# EAGLE schematic coyoho-easyvr (EAGLE 5.10)
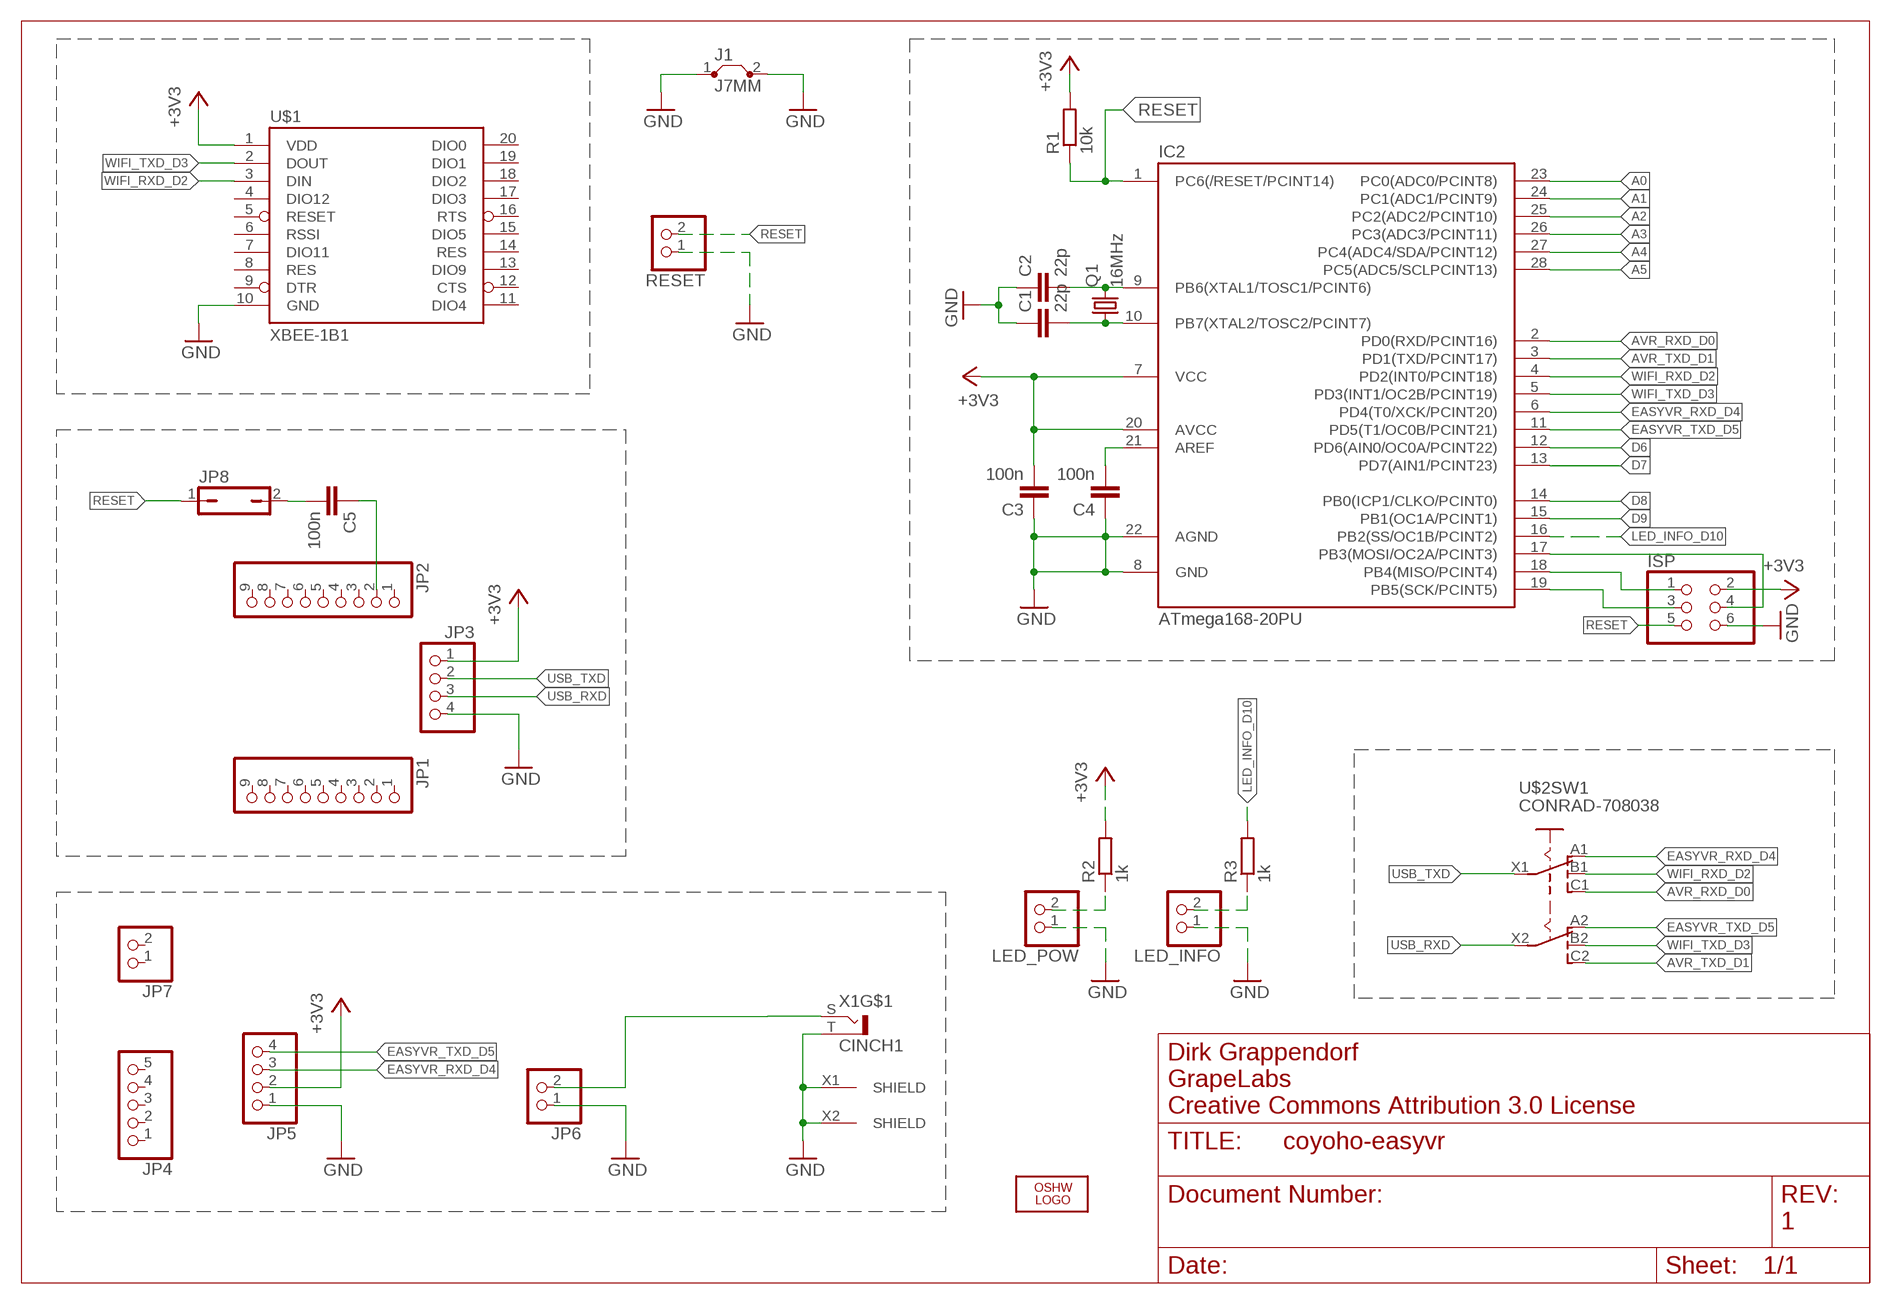
[diagram p0: schematic, sheet 1]

## Parts
C1  22p  C-EU025-025X050  [C025-025X050]
C2  22p  C-EU025-025X050  [C025-025X050]
C3  100n  C-EU025-024X044  [C025-024X044]
C4  100n  C-EU025-024X044  [C025-024X044]
C5  100n  C-EU025-024X044  [C025-024X044]
IC2  ATmega168-20PU  ATMEGA48/88/168-PU  [DIL28-3]
ISP  PINHD-2X3  [2X03]
J1  J7MM  [07]
JP1  PINHD-1X9  [1X09]
JP2  PINHD-1X9  [1X09]
JP3  PINHD-1X4  [1X04]
JP4  PINHD-1X5_2.00  [1X05M]
JP5  PINHD-1X4_2.00  [1X04M]
JP6  PINHD-1X2_2.00  [1X02M]
JP7  PINHD-1X2_2.00  [1X02M]
JP8  JP1Q  [JP1]
LED_INFO  PINHD-1X2_2.54  [1X02]
LED_POW  PINHD-1X2_2.54  [1X02]
LOGO2  OSHW_LOGO_10MILX0350-NT-BOTTOM  [OSHW_10X350_NOTEXT_BOTTOM]
Q1  16MHz  CRYSTALHC49U-V  [HC49U-V]
R1  10k  R-EU_0204/7  [0204/7]
R2  1k  R-EU_0204/7  [0204/7]
R3  1k  R-EU_0204/7  [0204/7]
RESET  PINHD-1X2_2.54  [1X02]
U$1  XBEE-1B1  [XBEE-1]
U$2  CONRAD-708038  [CONRAD-708038]
X1  CINCH1  [CINCH1]

## Nets
+3V3: C3.2 IC2.7(VCC) IC2.20(AVCC) ISP.2 JP3.1 JP5.2 R1.2 R2.2 U$1.1(VDD)
A0: IC2.23(PC0(ADC0/PCINT8))
A1: IC2.24(PC1(ADC1/PCINT9))
A2: IC2.25(PC2(ADC2/PCINT10))
A3: IC2.26(PC3(ADC3/PCINT11))
A4: IC2.27(PC4(ADC4/SDA/PCINT12))
A5: IC2.28(PC5(ADC5/SCLPCINT13))
AVR_RXD_D0: IC2.2(PD0(RXD/PCINT16)) U$2.C1(SW1:C1)
AVR_TXD_D1: IC2.3(PD1(TXD/PCINT17)) U$2.C2(SW1:C2)
D6: IC2.12(PD6(AIN0/OC0A/PCINT22))
D7: IC2.13(PD7(AIN1/PCINT23))
D8: IC2.14(PB0(ICP1/CLKO/PCINT0))
D9: IC2.15(PB1(OC1A/PCINT1))
EASYVR_RXD_D4: IC2.6(PD4(T0/XCK/PCINT20)) JP5.3 U$2.A1(SW1:A1)
EASYVR_TXD_D5: IC2.11(PD5(T1/OC0B/PCINT21)) JP5.4 U$2.A2(SW1:A2)
GND: C1.1 C2.1 C3.1 C4.1 IC2.8(GND) IC2.22(AGND) ISP.6 J1.1 J1.2 JP3.4 JP5.1 JP6.1 LED_INFO.1 LED_POW.1 RESET.1 U$1.10(GND) X1.T X1.X1(SHIELD) X1.X2(SHIELD)
LED_INFO_D10: IC2.16(PB2(SS/OC1B/PCINT2)) R3.2
MIC: JP6.2 X1.S
N$5: C2.2 IC2.9(PB6(XTAL1/TOSC1/PCINT6)) Q1.2
N$6: C1.2 IC2.10(PB7(XTAL2/TOSC2/PCINT7)) Q1.1
N$7: C4.2 IC2.21(AREF)
N$8: IC2.18(PB4(MISO/PCINT4)) ISP.1
N$9: IC2.19(PB5(SCK/PCINT5)) ISP.3
N$10: C5.2 JP8.2
N$11: C5.1 JP2.2
N$12: LED_POW.2 R2.1
N$13: LED_INFO.2 R3.1
N$22: IC2.17(PB3(MOSI/OC2A/PCINT3)) ISP.4
RESET: IC2.1(PC6(/RESET/PCINT14)) ISP.5 JP8.1 R1.1 RESET.2
USB_RXD: JP3.3 U$2.X2(SW1:X2)
USB_TXD: JP3.2 U$2.X1(SW1:X1)
WIFI_RXD_D2: IC2.4(PD2(INT0/PCINT18)) U$1.3(DIN) U$2.B1(SW1:B1)
WIFI_TXD_D3: IC2.5(PD3(INT1/OC2B/PCINT19)) U$1.2(DOUT) U$2.B2(SW1:B2)
Unconnected: JP1.1 JP1.2 JP1.3 JP1.4 JP1.5 JP1.6 JP1.7 JP1.8 JP1.9 JP2.1 JP2.3 JP2.4 JP2.5 JP2.6 JP2.7 JP2.8 JP2.9 JP4.1 JP4.2 JP4.3 JP4.4 JP4.5 JP7.1 JP7.2 U$1.4(DIO12) U$1.5(RESET) U$1.6(RSSI) U$1.7(DIO11) U$1.8(RES) U$1.9(DTR) U$1.11(DIO4) U$1.12(CTS) U$1.13(DIO9) U$1.14(RES) U$1.15(DIO5) U$1.16(RTS) U$1.17(DIO3) U$1.18(DIO2) U$1.19(DIO1) U$1.20(DIO0) U$2.SHIELD1(SHIELD1:SHIELD) U$2.SHIELD2(SHIELD2:SHIELD)

## Notes on the sheet
- Dirk Grappendorf
- GrapeLabs
- Creative Commons Attribution 3.0 License
- 1

## Library data of the parts
C1-C5 = rcl:C-EU: CAPACITOR, European symbol
IC2 = atmega8:ATMEGA48/88/168-PU
ISP = pinhead:PINHD-2X3: PIN HEADER
J1 = jumper:J: Bridge
JP1 JP2 = pinhead:PINHD-1X9: PIN HEADER
JP3 = pinhead:PINHD-1X4: PIN HEADER
JP4 = pinhead-1:PINHD-1X5: PIN HEADER
JP5 = pinhead-1:PINHD-1X4: PIN HEADER
JP6 JP7 LED_INFO LED_POW RESET = pinhead-1:PINHD-1X2: PIN HEADER
JP8 = jumper:JP1Q: JUMPER
LOGO2 = OSHW:OSHW_LOGO_10MIL
Q1 = crystal:CRYSTAL: CRYSTAL
R1-R3 = rcl:R-EU_: RESISTOR, European symbol
U$1 = grapelabs:XBEE-1
U$2 = grapelabs-switches:CONRAD-708038
X1 = grapelabs-connectors:CINCH1: RCA connectors according to JEITA RC-5231 Cinch RCA-Einbaukupplung nach JEITA RC-5231, abgewinkelte Ausführung Source: http://www.lumberg.de/Produkte/PDFs/WBTOR1.pdf